# EAGLE board FLYTE_3.02 (EAGLE 9.6.2)
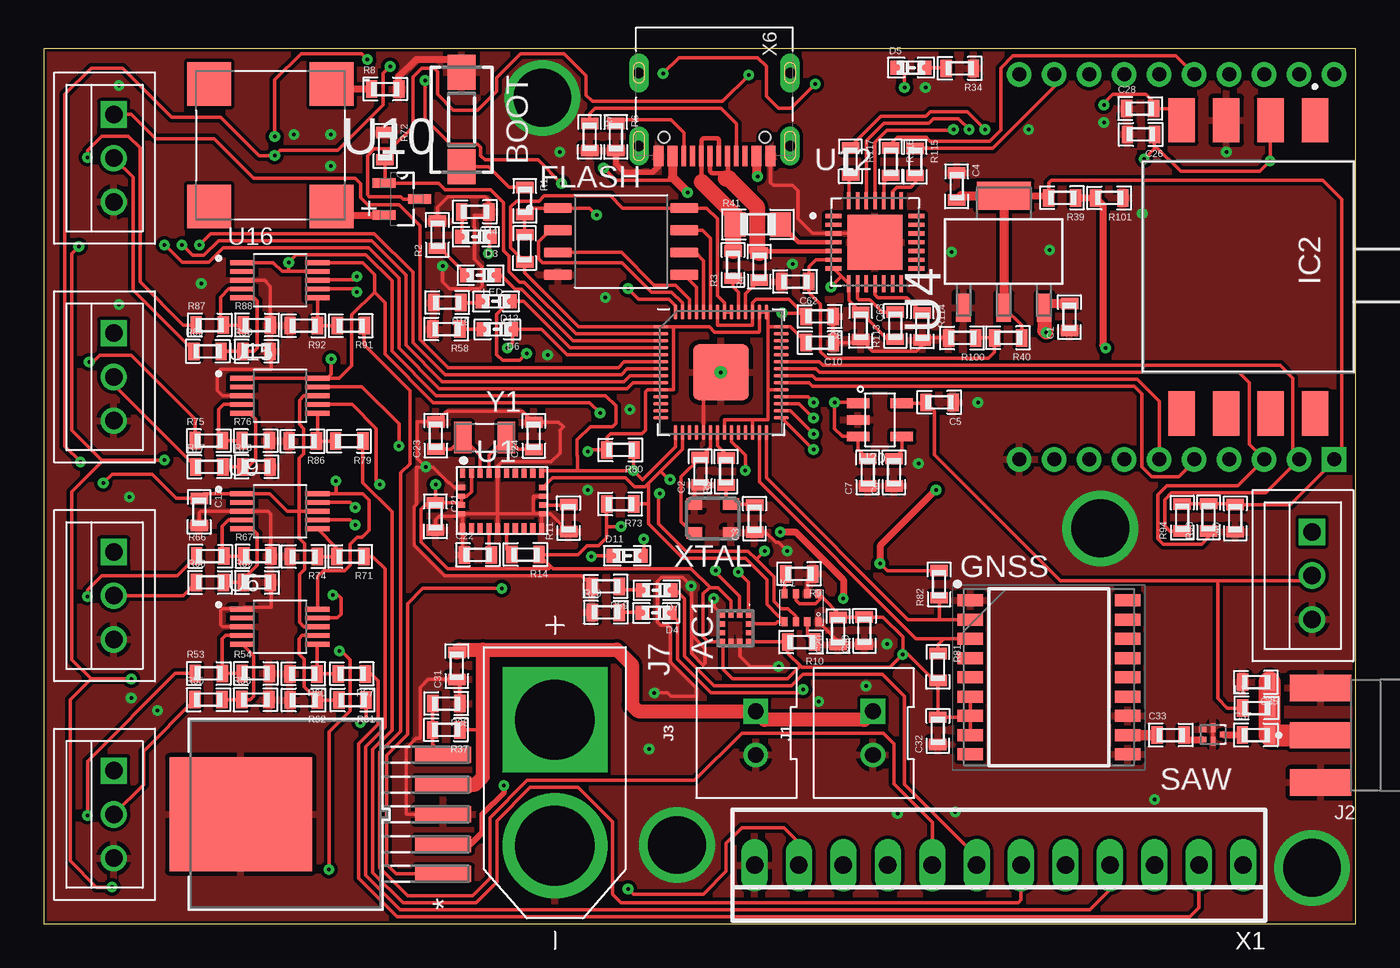
[diagram p8: board, top side]
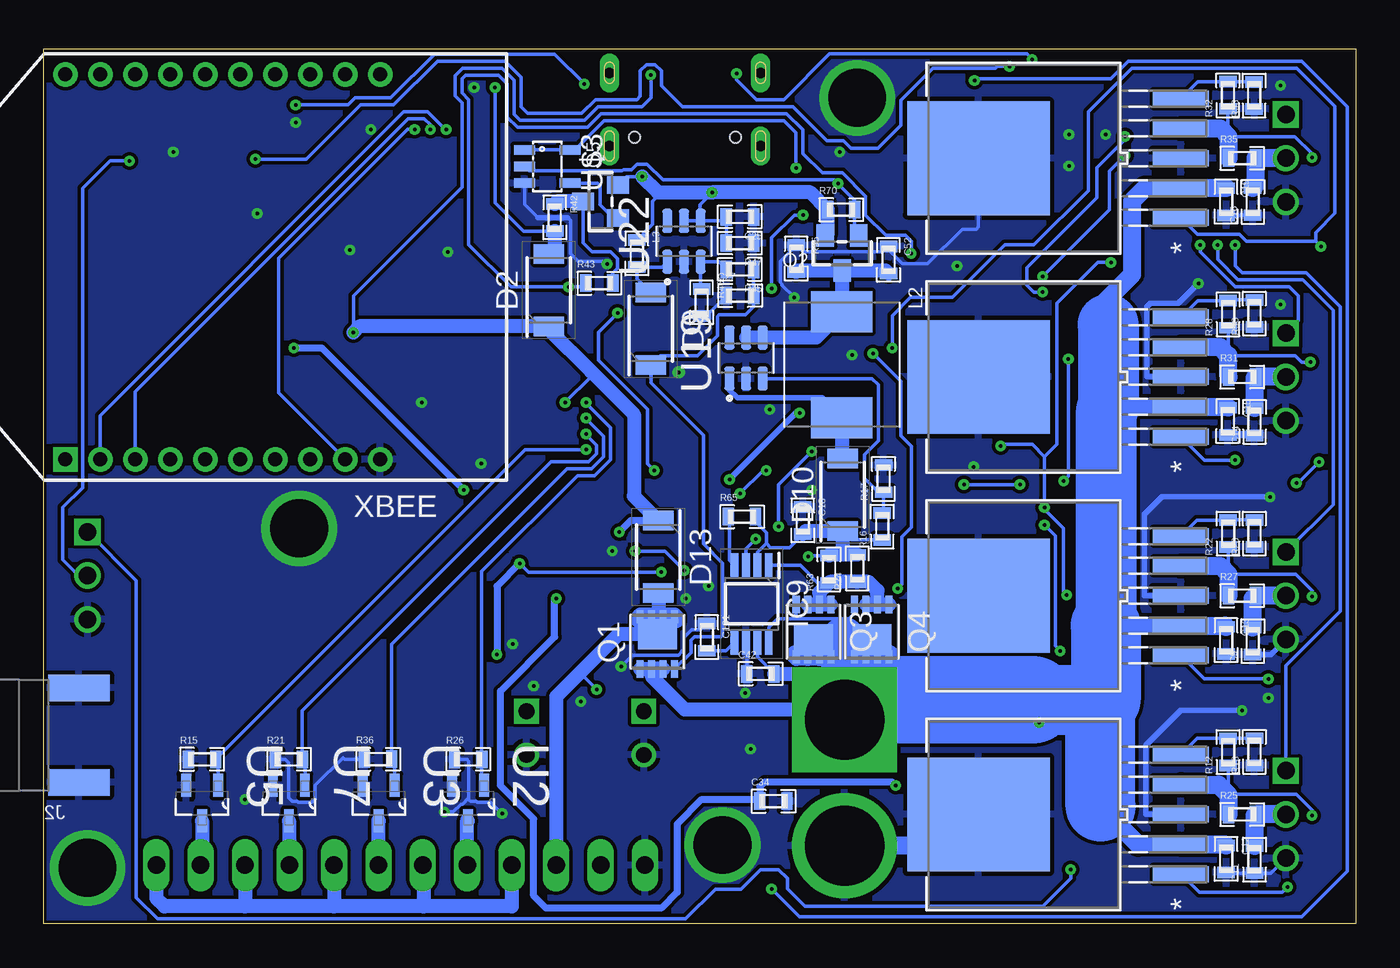
[diagram p9: board, bottom side, seen from below]

Size 75 x 50 mm. Coordinates in mm from the lower left corner, seen from the top.
Outline: 0,0 75,0 75,50 0,50 0,0
Copper layers (1*16): Top 0.07mm / dielectric 1.5mm / Bottom 0.07mm
Design rules "default *": minimum track width 0.2mm, minimum drill 0.2mm, track to track 0.2mm, track to pad 0.2mm, pad to pad 0.2mm, via to via 0.2mm, smd to smd 0.2mm, copper to edge 0.175mm, drill to drill 6mil, minimum pad ring 10mil, minimum via ring 8mil, stop-mask expansion 4mil, vias tented up to drill 0mil, thermal gap 10mil

## Footprints (pad centres in the part's own frame; a part is rotated, then mirrored left to right if it is on the bottom)
KX1341211 = smd 0.3 x 0.3: 1 -0.762,0.75; 2 -0.762,0.25; 3 -0.762,-0.25; 4 -0.762,-0.75; 5 -0.25,-0.75; 6 0.25,-0.75; 7 0.762,-0.75; 8 0.762,-0.25; 9 0.762,0.25; 10 0.762,0.75; 11 0.25,0.75; 12 -0.25,0.75
DTSM-3 = smd 2 x 1.6: 1 -2.7,0; 2 2.7,0
CUI_CMT-8530S-SMT = smd 2.5 x 2.5: 1 -3.5,3.5; 2 -3.5,-3.5; N 3.5,3.5; P 3.5,-3.5
0603 = smd 0.65 x 1: 1 -0.775,0; 2 0.775,0
SODFL4725X105N = smd 1.12 x 1.72: 1 -2.075,0; 2 2.075,0
0603.LED = smd 0.8 x 0.8: P$1 -0.775,0; P$2 0.775,0
B3B-XH = drill 1 square: P$1 2.5,0 | drill 1: P$2 0,0; P$3 -2.5,0
SOIC127P790X216-8N = smd 1.61 x 0.58: 1 -3.605,1.905; 2 -3.605,0.635; 3 -3.605,-0.635; 4 -3.605,-1.905; 5 3.605,-1.905; 6 3.605,-0.635; 7 3.605,0.635; 8 3.605,1.905
SON110P970X1010X230-18N = smd 1.45 x 0.686: 1 -4.5,4.4; 2 -4.5,3.3; 3 -4.5,2.2; 4 -4.5,1.1; 5 -4.5,0; 6 -4.5,-1.1; 7 -4.5,-2.2; 8 -4.5,-3.3; 9 -4.5,-4.4; 10 4.5,-4.4; 11 4.5,-3.3; 12 4.5,-2.2; 13 4.5,-1.1; 14 4.5,0; 15 4.5,1.1; 16 4.5,2.2; 17 4.5,3.3; 18 4.5,4.4
BMP280 = smd 0.35 x 0.5: 1 0.975,-0.8; 2 0.325,-0.8; 3 -0.325,-0.8; 4 -0.975,-0.8; 5 -0.975,0.8; 6 -0.325,0.8; 7 0.325,0.8; 8 0.975,0.8
MPXV5100DP = smd 2.54 x 1.52: 1 8.38,-3.81; 2 8.38,-1.27; 3 8.38,1.27; 4 8.38,3.81; 5 -8.38,3.81; 6 -8.38,1.27; 7 -8.38,-1.27; 8 -8.38,-3.81
SOP65P490X110-8N = smd 1.4 x 0.45: 1 -2.2,0.975; 2 -2.2,0.325; 3 -2.2,-0.325; 4 -2.2,-0.975; 5 2.2,-0.975; 6 2.2,-0.325; 7 2.2,0.325; 8 2.2,0.975
B2B-XH-A = drill 0.9 square: 1 1.25,0 | drill 0.9: 2 -1.25,0
RFSOLUTIONS_CON-SMA-EDGE-S = smd 3.5 x 1.5: 1 0,0; G1 0,2.7; G2 0,-2.7 | smd 3.5 x 1.5 bottom: G3 0,2.7; G4 0,-2.7
AMASS_XT60-M = drill 4.55 pad 6: N 3.6,0 | drill 4.55 pad 6 square: P -3.6,0
IND_ASPI-0630LR-220M-T15 = smd 2.35 x 3.5: 1 -3.025,0; 2 3.025,0
SIS862DNT1GE3 = smd 0.99 x 0.405: 1 -1.555,0.992; 2 -1.555,0.332; 3 -1.555,-0.328; 4 -1.555,-0.988 | smd 0.51 x 0.405: 5 1.555,-0.988; 6 1.555,-0.328; 7 1.555,0.332; 8 1.555,0.992 | smd 1.725 x 2.235: 9 0.438,0.002 | smd 0.25 x 0.2: 10 1.175,-1.096; 11 1.175,1.096
SOT23-WIDE = smd 1 x 1.27: 1 -0.95,-1; 2 0.95,-1; 3 0,1
0805 = smd 1.2 x 1.4: 1 -1.3,0; 2 1.3,0
RP2040-QFN-56 = smd 0.875 x 0.2: 1 -3.438,2.6; 2 -3.438,2.2; 3 -3.438,1.8; 4 -3.438,1.4; 5 -3.438,1; 6 -3.438,0.6; 7 -3.438,0.2; 8 -3.438,-0.2; 9 -3.438,-0.6; 10 -3.438,-1; 11 -3.438,-1.4; 12 -3.438,-1.8; 13 -3.438,-2.2; 14 -3.438,-2.6; 29 3.438,-2.6; 30 3.438,-2.2; 31 3.438,-1.8; 32 3.438,-1.4; 33 3.438,-1; 34 3.438,-0.6; 35 3.438,-0.2; 36 3.438,0.2; 37 3.438,0.6; 38 3.438,1; 39 3.438,1.4; 40 3.438,1.8; 41 3.438,2.2; 42 3.438,2.6 | smd 0.2 x 0.875: 15 -2.6,-3.438; 16 -2.2,-3.438; 17 -1.8,-3.438; 18 -1.4,-3.438; 19 -1,-3.438; 20 -0.6,-3.438; 21 -0.2,-3.438; 22 0.2,-3.438; 23 0.6,-3.438; 24 1,-3.438; 25 1.4,-3.438; 26 1.8,-3.438; 27 2.2,-3.438; 28 2.6,-3.438; 43 2.6,3.438; 44 2.2,3.438; 45 1.8,3.438; 46 1.4,3.438; 47 1,3.438; 48 0.6,3.438; 49 0.2,3.438; 50 -0.2,3.438; 51 -0.6,3.438; 52 -1,3.438; 53 -1.4,3.438; 54 -1.8,3.438; 55 -2.2,3.438; 56 -2.6,3.438 | smd 3.2 x 3.2: 57 0,0 | drill 0.2 pad 0.6: 62 0,0
FIL_AFS14A04-1575.42-T3 = smd 0.425 x 0.325: A 0.588,0.287; C -0.588,0; E 0.588,-0.287 | smd 0.25 x 0.525: B 0,0.388; D 0,-0.388
LGA28R50P4X10_380X520X100 = smd 0.3 x 0.525: 1 -2.25,1.562; 6 -2.25,-1.562; 7 -1.75,-1.562; 8 -1.25,-1.562; 9 -0.75,-1.562; 10 -0.25,-1.562; 11 0.25,-1.562; 12 0.75,-1.562; 13 1.25,-1.562; 14 1.75,-1.562; 15 2.25,-1.562; 20 2.25,1.562; 21 1.75,1.562; 22 1.25,1.562; 23 0.75,1.562; 24 0.25,1.562; 25 -0.25,1.562; 26 -0.75,1.562; 27 -1.25,1.562; 28 -1.75,1.562 | smd 0.425 x 0.3: 2 -2.312,0.75; 3 -2.312,0.25; 4 -2.312,-0.25; 5 -2.312,-0.75; 16 2.312,-0.75; 17 2.312,-0.25; 18 2.312,0.25; 19 2.312,0.75
SOT91P240X120-3N = smd 1.321 x 0.559: 1 -1.016,0.914; 2 -1.016,-0.914; 3 1.016,0
SOT230 = smd 1.6 x 0.838: 1 -3.2,2.311; 2 -3.2,0; 3 -3.2,-2.311 | smd 1.6 x 3.099: 4 3.2,0
SOP50P490X110-10N = smd 1.47 x 0.28: 1 -2.15,1; 2 -2.15,0.5; 3 -2.15,0; 4 -2.15,-0.5; 5 -2.15,-1; 6 2.15,-1; 7 2.15,-0.5; 8 2.15,0; 9 2.15,0.5; 10 2.15,1
TO-263-5_MCH-L = smd 0.914 x 3.2: 1 -3.404,-9.004; 2 -1.702,-9.004; 3 0,-9.004; 4 1.702,-9.004; 5 3.404,-9.004 | smd 6.502 x 8.153: 6 0,2.565
QFN50P500X500X100-29N = smd 0.97 x 0.26: 1 -2.37,1.5; 2 -2.37,1; 3 -2.37,0.5; 4 -2.37,0; 5 -2.37,-0.5; 6 -2.37,-1; 7 -2.37,-1.5; 15 2.37,-1.5; 16 2.37,-1; 17 2.37,-0.5; 18 2.37,0; 19 2.37,0.5; 20 2.37,1; 21 2.37,1.5 | smd 0.26 x 0.97: 8 -1.5,-2.37; 9 -1,-2.37; 10 -0.5,-2.37; 11 0,-2.37; 12 0.5,-2.37; 13 1,-2.37; 14 1.5,-2.37; 22 1.5,2.37; 23 1,2.37; 24 0.5,2.37; 25 0,2.37; 26 -0.5,2.37; 27 -1,2.37; 28 -1.5,2.37 | smd 3.15 x 3.15: 29 0,0
SOT95P280X145-6N = smd 1.37 x 0.59: 1 -1.17,0.95; 2 -1.17,0; 3 -1.17,-0.95; 4 1.17,-0.95; 5 1.17,0; 6 1.17,0.95
SOT-23-5_RAW = smd 0.55 x 1.3: 1 -0.95,-1.25; 2 0,-1.25; 3 0.95,-1.25; 4 0.95,1.25; 5 -0.95,1.25
SOT23-5 = smd 0.55 x 1.2: 1 -0.95,-1.3; 2 0,-1.3; 3 0.95,-1.3; 4 0.95,1.3; 5 -0.95,1.3
22-23-2121 = drill 1 long: 1 -13.97,0; 2 -11.43,0; 3 -8.89,0; 4 -6.35,0; 5 -3.81,0; 6 -1.27,0; 7 1.27,0; 8 3.81,0; 9 6.35,0; 10 8.89,0; 11 11.43,0; 12 13.97,0
USB_C_CUSB31-CFM2AX-01-X = smd 0.575 x 1.15: A1B12 -3.2,3.545; A4B9 -2.4,3.545; B1A12 3.2,3.545; B4A9 2.4,3.545 | smd 0.275 x 1.15: A5 -1.25,3.545; A6 -0.25,3.545; A7 0.25,3.545; A8 1.25,3.545; B5 1.75,3.545; B6 0.75,3.545; B7 -0.75,3.545; B8 -1.75,3.545 | drill 0.6 pad 1 long: M1 -4.32,2.97; M2 4.32,2.97; M3 -4.32,-1.21; M4 4.32,-1.21 | hole 0.65: 2.89,2.47; -2.89,2.47
DIP2200W51P200L3294H279Q20P = drill 0.8 pad 1.4 square: 1 -11,8.75 | drill 0.8 pad 1.4: 2 -11,6.75; 3 -11,4.75; 4 -11,2.75; 5 -11,0.75; 6 -11,-1.25; 7 -11,-3.25; 8 -11,-5.25; 9 -11,-7.25; 10 -11,-9.25; 11 11,-9.25; 12 11,-7.25; 13 11,-5.25; 14 11,-3.25; 15 11,-1.25; 16 11,0.75; 17 11,2.75; 18 11,4.75; 19 11,6.75; 20 11,8.75
ASE = smd 0.9 x 0.65: 1 -1.05,-0.825; 2 1.05,-0.825; 3 1.05,0.825; 4 -1.05,0.825
XTAL_FC-135_32.7680KA-A0 = smd 1 x 1.8: 1 -1.25,0; 2 1.25,0

## Placement (x,y rotation side)
AC1  KX134-1211  [KX1341211]  39.53,16.89 270 top
BOOT  DTSM-3  [DTSM-3]  23.88,45.95 270 top
BUZZER  BUZZER  [CUI_CMT-8530S-SMT]  12.96,44.49 0 top
C1  10 uF  [0603]  58.63,34.68 90 top
C2  18 pF  [0603]  37.53,25.87 90 top
C3  18 pF  [0603]  40.63,23.16 90 top
C4  10 uF  [0603]  52.19,42.14 270 top
C5  10 uF  [0603]  51.2,29.8 180 top
C6  100 pF  [0603]  48.6,25.8 90 top
C7  10 uF  [0603]  47.1,25.8 90 top
C8  10 uF  [0603]  44.35,34.71 180 top
C9  10 uF  [0603]  5.89,16.16 90 bottom
C10  10 uF  [0603]  44.37,33.21 180 top
C11  10 uF  [0603]  5.79,3.68 90 bottom
C12  10 uF  [0603]  7.41,3.71 270 bottom
C13  10 uF  [0603]  7.41,16.2 270 bottom
C14  10 uF  [0603]  5.79,28.69 90 bottom
C15  10 uF  [0603]  7.31,28.72 270 bottom
C16  10 uF  [0603]  5.89,41.27 90 bottom
C17  10 uF  [0603]  8.89,23.54 270 top
C18  10\ uF  [0603]  31.61,23.05 270 bottom
C19  10 uF  [0603]  7.41,41.26 270 bottom
C20  10 uF  [0603]  45.41,16.73 90 top
C21  10 uF  [0603]  22.39,23.28 270 top
C22  100 nF  [0603]  24.81,21.09 0 top
C23  27 pF  [0603]  22.41,27.9 90 top
C24  27 pF  [0603]  28.01,27.89 90 top
C25  10 uF  [0603]  35.2,40.4 180 bottom
C26  10 uF  [0603]  62.72,45.11 180 top
C27  10\ uF  [0603]  35.2,35.9 0 bottom
C28  470 pF  [0603]  62.67,46.59 0 top
C30  10 uF  [0603]  46.91,16.75 90 top
C31  10 uF  [0603]  23.61,14.74 90 top
C32  10 uF  [0603]  51.11,11.03 90 top
C33  120 pF  [0603]  64.42,10.79 0 top
C34  10 uF  [0603]  33.29,7.01 0 bottom
C35  120 pF  [0603]  69.3,13.81 180 top
C37  120 pF  [0603]  69.29,10.79 0 top
C40  10 uF  [0603]  68.11,23.18 90 top
C42  10 uF  [0603]  34.03,14.29 0 bottom
C52  10 uF  [0603]  26.71,37.94 270 bottom
C62  10 uF  [0603]  42.96,36.7 180 top
C63  10 uF  [0603]  46.7,34.17 270 top
C101  100 nF  [0603]  37.1,16.38 270 bottom
D2  RSX501LAM20TR  [SODFL4725X105N]  46.13,36.21 90 bottom
D3  [0603.LED]  24.7,39.27 180 top
D4  [0603.LED]  35.01,17.77 180 top
D5  [0603.LED]  49.58,48.93 0 top
D6  [0603.LED]  25.93,33.97 180 top
D7  [0603.LED]  35.04,19.07 180 top
D9  RSX501LAM20TR  [SODFL4725X105N]  40.3,34 90 bottom
D10  RSX501LAM20TR  [SODFL4725X105N]  29.33,24.52 90 bottom
D11  [0603.LED]  33.35,21.03 0 top
D12  [0603.LED]  25.86,35.57 180 top
D13  RSX501LAM20TR  [SODFL4725X105N]  39.87,20.97 270 bottom
FIN_1  03-JST-B3B-XH-A  [B3B-XH]  4,6.25 90 top
FIN_2  03-JST-B3B-XH-A  [B3B-XH]  4,18.75 90 top
FIN_3  03-JST-B3B-XH-A  [B3B-XH]  4,31.25 90 top
FIN_4  03-JST-B3B-XH-A  [B3B-XH]  4,43.75 90 top
FLASH  W25Q128JVSIQ  [SOIC127P790X216-8N]  33,39 0 top
GNSS  TESEO-LIV3F  [SON110P970X1010X230-18N]  57.46,14.09 0 top
IC1  BMP280  [BMP280]  43.32,18.07 0 top
IC2  MPXV5100DP  [MPXV5100DP]  68.86,37.54 90 top
IC9  MCP73844-840I_MS  [SOP65P490X110-8N]  34.53,18.29 270 bottom
J1  JST-XH-2B  [B2B-XH-A]  47.4,10.9 90 top
J2  CON-SMA-EDGE-S  [RFSOLUTIONS_CON-SMA-EDGE-S]  72.99,10.78 180 top
J3  JST-XH-2B  [B2B-XH-A]  40.7,10.9 90 top
J7  XT60-M  [AMASS_XT60-M]  29.22,8.06 270 top
L1  [0603]  69.31,12.33 0 top
L2  ASPI-0630LR-220M-T15  [IND_ASPI-0630LR-220M-T15]  29.38,31.95 270 bottom
L3  22 uH  [0603]  41.1,38.3 270 bottom
LED  [0603.LED]  24.97,37.07 180 top
MOTOR  03-JST-B3B-XH-A  [B3B-XH]  72.5,19.9 90 top
Q1  SI7625DN-T1-GE3  [SIS862DNT1GE3]  39.92,16.12 90 bottom
Q2  [SOT23-WIDE]  29.37,38.33 180 bottom
Q3  SI7625DN-T1-GE3  [SIS862DNT1GE3]  31,16.69 270 bottom
Q4  SI7625DN-T1-GE3  [SIS862DNT1GE3]  27.67,16.69 270 bottom
Q5  [SOT23-WIDE]  43.17,41.28 90 bottom
R0  10k ohm  [0603]  27.49,38.6 270 top
R1  1k ohm  [0603]  27.5,41.31 270 top
R2  100 ohm  [0603]  22.5,39.38 90 top
R3  27.4 ohm  [0603]  39.4,37.67 90 top
R4  27.4 ohm  [0603]  40.9,37.56 90 top
R5  1k ohm  [0603]  39,25.85 90 top
R6  5.1k ohm  [0603]  32.7,44.96 270 top
R7  5.1k ohm  [0603]  31.2,44.97 270 top
R8  100 ohm  [0603]  19.52,47.7 0 top
R9  10k ohm  [0603]  43.19,20 180 top
R10  10k ohm  [0603]  43.3,16.1 180 top
R11  10k ohm  [0603]  30,23.19 90 top
R12  45k ohm  [0603]  7.3,9.82 90 bottom
R13  10k ohm  [0603]  5.8,9.83 90 bottom
R14  10k ohm  [0603]  27.54,21.1 180 top
R15  10k ohm  [0603]  65.95,9.4 0 bottom
R16  145k ohm  [0603]  27.07,22.71 90 bottom
R17  10k ohm  [0603]  27,25.44 90 bottom
R19  100 ohm  [0603]  23.07,35.5 180 top
R21  10k ohm  [0603]  60.99,9.4 0 bottom
R22  45k ohm  [0603]  7.3,22.3 90 bottom
R23  10k ohm  [0603]  5.8,22.31 90 bottom
R24  0.13 ohm  [0603]  28.5,20.32 90 bottom
R25  0.13 ohm  [0603]  6.5,6.25 0 bottom
R26  10k ohm  [0603]  50.74,9.4 0 bottom
R27  0.13 ohm  [0603]  6.5,18.75 0 bottom
R28  45k ohm  [0603]  7.3,34.84 90 bottom
R29  100 ohm  [0603]  32.13,17.8 0 top
R30  10k ohm  [0603]  5.8,34.88 90 bottom
R31  0.13 ohm  [0603]  6.5,31.25 0 bottom
R32  45k ohm  [0603]  7.31,47.35 90 bottom
R33  10k ohm  [0603]  5.81,47.34 90 bottom
R34  100 ohm  [0603]  52.37,48.89 180 top
R35  0.13 ohm  [0603]  6.5,43.75 0 bottom
R36  10k ohm  [0603]  55.89,9.41 0 bottom
R37  30k ohm  [0603]  23,11.09 180 top
R38  10k ohm  [0603]  23.01,12.59 180 top
R39  0 ohm  [0603]  58.22,41.49 180 top
R40  0 ohm  [0603]  55.13,33.49 180 top
R41  0 ohm  [0805]  40.82,39.97 0 top
R42  0 ohm  [0603]  45.79,40.36 270 bottom
R43  0 ohm  [0603]  43.25,36.61 0 bottom
R44  100 ohm  [0603]  24.66,40.69 180 top
R45  190k ohm  [0603]  35.2,37.4 180 bottom
R46  10k ohm  [0603]  37.4,35.5 270 bottom
R47  10k ohm  [0603]  35.2,38.9 180 bottom
R53  10k ohm  [0603]  9.43,14.31 0 top
R54  10k ohm  [0603]  12.12,14.31 0 top
R55  10k ohm  [0603]  9.41,12.81 0 top
R56  10k ohm  [0603]  12.1,12.81 0 top
R57  10k ohm  [0603]  17.61,14.29 180 top
R58  100 ohm  [0603]  23.02,33.99 180 top
R59  315 ohm  [0603]  32.13,19.29 180 top
R60  10k ohm  [0603]  14.84,14.29 180 top
R61  10k ohm  [0603]  17.65,12.79 180 top
R62  10k ohm  [0603]  14.86,12.79 180 top
R63  0.13 ohm  [0603]  30.11,20.27 90 bottom
R65  100k ohm  [0603]  35.09,23.27 0 bottom
R66  10k ohm  [0603]  9.52,21.01 0 top
R67  10k ohm  [0603]  12.21,21.01 0 top
R68  10k ohm  [0603]  9.5,19.51 0 top
R69  10k ohm  [0603]  12.19,19.51 0 top
R70  10k ohm  [0603]  29.42,40.81 0 bottom
R71  10k ohm  [0603]  17.53,20.99 180 top
R72  10k ohm  [0603]  19.51,44.44 270 top
R73  10k ohm  [0603]  32.95,23.99 180 top
R74  10k ohm  [0603]  14.86,20.99 180 top
R75  10k ohm  [0603]  9.43,27.61 0 top
R76  10k ohm  [0603]  12.12,27.61 0 top
R77  10k ohm  [0603]  9.46,26.12 0 top
R78  10k ohm  [0603]  12.15,26.12 0 top
R79  10k ohm  [0603]  17.46,27.58 180 top
R80  10k ohm  [0603]  32.97,27.08 180 top
R81  10k ohm  [0603]  51.12,14.68 270 top
R82  10k ohm  [0603]  51.18,19.41 90 top
R86  10k ohm  [0603]  14.8,27.58 180 top
R87  10k ohm  [0603]  9.49,34.22 0 top
R88  10k ohm  [0603]  12.18,34.22 0 top
R89  10k ohm  [0603]  9.37,32.72 0 top
R90  10k ohm  [0603]  12.16,32.72 0 top
R91  10k ohm  [0603]  17.55,34.18 180 top
R92  10k ohm  [0603]  14.86,34.18 180 top
R93  10k ohm  [0603]  66.58,23.23 90 top
R94  10k ohm  [0603]  65.08,23.22 90 top
R95  10k ohm  [0603]  31.98,38.01 270 bottom
R100  10k ohm  [0603]  52.5,33.48 180 top
R101  10k ohm  [0603]  60.91,41.48 180 top
R113  10k ohm  [0603]  48.68,34.18 90 top
R114  10k ohm  [0603]  50.22,34.13 270 top
R115  0 ohm  [0603]  49.82,43.54 270 top
R116  0 ohm  [0603]  48.42,43.55 270 top
R117  0 ohm  [0603]  46.12,43.56 270 top
RP2040  RP2040-QFN56  [RP2040-QFN-56]  38.71,31.52 0 top
SAW  SAW_FILTER  [FIL_AFS14A04-1575.42-T3]  66.84,10.82 180 top
U1  BNO055  [LGA28R50P4X10_380X520X100]  26.2,24.18 0 top
U2  CJ3400  [SOT91P240X120-3N]  50.75,6.9 270 bottom
U3  CJ3400  [SOT91P240X120-3N]  55.85,6.9 270 bottom
U4  LM1117-3.3  [SOT230]  54.88,38.42 90 top
U5  CJ3400  [SOT91P240X120-3N]  65.95,6.9 270 bottom
U6  ADS1115IDGSR  [SOP50P490X110-10N]  13.5,16.98 0 top
U7  CJ3400  [SOT91P240X120-3N]  60.98,6.9 270 bottom
U8  MIC29302WU-TRTO-263-5_MCH-L  [TO-263-5_MCH-L]  13.83,6.26 90 top
U9  ADS1115IDGSR  [SOP50P490X110-10N]  13.5,23.58 0 top
U10  CJ3400  [SOT91P240X120-3N]  20.48,41.42 0 top
U11  MIC29302WU-TRTO-263-5_MCH-L  [TO-263-5_MCH-L]  19,6.25 90 bottom
U12  CP2102  [QFN50P500X500X100-29N]  47.52,38.95 0 top
U13  MIC29302WU-TRTO-263-5_MCH-L  [TO-263-5_MCH-L]  19,18.75 90 bottom
U14  MIC29302WU-TRTO-263-5_MCH-L  [TO-263-5_MCH-L]  19,31.25 90 bottom
U15  ADS1115IDGSR  [SOP50P490X110-10N]  13.5,30.18 0 top
U16  ADS1115IDGSR  [SOP50P490X110-10N]  13.5,36.78 0 top
U17  MIC29302WU-TRTO-263-5_MCH-L  [TO-263-5_MCH-L]  19,43.75 90 bottom
U19  MT3608  [SOT95P280X145-6N]  34.85,32.33 90 bottom
U20  AP2210K-3.3TRG1  [SOT-23-5_RAW]  47.8,28.8 270 top
U22  MT3608  [SOT95P280X145-6N]  38.4,39 90 bottom
U$3  SN74LVC1G04DBVR  [SOT23-5]  46.22,43.28 270 bottom
X1  22-23-2121  [22-23-2121]  54.6,3.35 180 top
X6  USB Type C  [USB_C_CUSB31-CFM2AX-01-X]  38.34,47.42 180 top
XBEE  XBP9B-XCST-021  [DIP2200W51P200L3294H279Q20P]  65.02,37.54 90 bottom
XTAL  ASE  [ASE]  38.24,23.16 180 top
Y1  FC-135_32.7680KA-A0  [XTAL_FC-135_32.7680KA-A0]  25.2,27.78 0 top

## Tracks (layer width: path | path; a pad name or v marks a point on that pad's centre or on a via)
1V1  (via drill 0.2)
  Top 0.2: RP2040.50 38.51,34.22 40.51,34.22 RP2040.45 40.51,35.49 40.72,35.7 42.59,35.7 C8.2 43.38,34.9 v42.2,34.9 | RP2040.23 39.31,27.55 39.61,27.25 39.62,27.25 40.1,26.77 v40.1,25.9
  Bottom 0.2: v40.1,25.9 40.5,26.3 40.5,29.4 43.3,32.2 43.3,33.8 v42.2,34.9
3V3
  Top 0.2: U4.2 55.91,34.2 R40.1 | R94.2 65.09,24 R93.2 68.06,24 C40.2 71.25,23.95 73.77,26.47 73.77,26.5 | 73.77,26.5 XBEE.1 | R39.2 57.45,42.34 57.6,42.5 73.1,42.5 74.2,41.4 74.2,26.93 73.77,26.5
  Top 0.406: U4.4 57.31,41.62 R39.2
  Top 0.508: C4.2 52.45,41.62 U4.4 U4.2
3V3_OP  (via drill 0.2)
  Top 0.2: RP2040.48 RP2040.49 38.91,35.49 38.51,35.89 38.51,40.29 37.9,40.91 FLASH.8 33.09,40.91 32.4,41.6 28.61,41.6 28.32,41.3 27.02,41.3 26.69,40.97 26.69,38.62 R0.2 27.49,37.21 30.58,34.12 RP2040.1 36.01,34.12 | C10.2 42.69,34.12 RP2040.42 41.41,34.12 | RP2040.26 40.51,28.82 40.52,28.82 | 40.52,28.82 41.41,28.82 41.41,30.5 | 36.01,34.12 36.01,30.52 RP2040.10 34.52,30.52 34.4,30.4 34.4,28.2 34.2,28 32.4,28 32.2,27.8 R80.2 31.18,27.08 v31.1,27 | 41.41,34.12 41.41,34.96 RP2040.43 RP2040.44 40.91,33.85 40.88,33.82 38.34,33.82 38.04,34.12 36.01,34.12 | RP2040.22 38.91,28.82 40.52,28.82 | GNSS.6 GNSS.7 | GNSS.7 GNSS.8 | C21.1 23.76,24.05 U1.4 U1.3 24.17,24.43 24.45,24.71 U1.28 | 44.36,18.8 45.66,17.5 C20.2 45.43,17.52 C30.2 47.98,17.52 49.1,16.4 v49.1,15.4 | 44.36,18.8 IC1.8 | IC1.6 42.99,18.5 43.2,18.3 44.1,18.3 44.36,18.56 44.36,18.8 | GNSS.7 52.87,11.8 C32.2 51.12,11.81 R81.2 | R81.2 | U15.7 17.62,29.68 19,28.3 19,25.3 v19.2,25.1 | AC1.3 39.28,18.47 38.55,19.2 38.1,19.2 | 38.1,19.2 38.05,19.2 37.7,18.85 37.7,16.4 37.97,16.13 AC1.7 38.83,16.08 38.83,14.55 39.38,14 42.5,14 43.2,14.7 43.3,14.7 | R81.2 50.9,13.9 49.4,15.4 v49.1,15.4 | AC1.1 40.28,19.52 v39.7,20.1 | 29.01,20.41 R14.1 30.55,21.1 31.05,21.6 31.7,21.6 32.17,22.07 32.17,22.7 | 29.01,20.41 29.11,20.3 37,20.3 38.1,19.2 | C21.1 22.4,24.07 v22.4,25.1 | v47.8,20.6 48.22,20.18 R82.2 | 43.3,14.7 43.34,14.66 48.36,14.66 v49.1,15.4 | 32.17,22.7 R73.2 | 41.41,30.5 41.41,34.12 | 41.41,30.5 41.43,30.52 RP2040.33 | v33,22.7 32.17,22.7 | 29.01,20.41 28.89,20.29 23.09,20.29 21.58,21.8 21.58,23.68 21.95,24.05 C21.1 | 43.3,14.7 42.52,15.47 R10.2 42.5,16.13 AC1.10
  Top 0.406: R39.1 R101.2 60.53,41.08 60.53,33.06 v60.7,32.9 | v51,24.8 47.8,21.6 v47.8,20.6
  Bottom 0.2: v39.7,20.1 47.3,20.1 v47.8,20.6 | v19.2,25.1 v22.4,25.1 | v33,22.7 33,25.1 v31.1,27
  Bottom 0.406: v51,24.8 59.1,32.9 v60.7,32.9 | v47.8,20.6 49.1,19.3 v49.1,15.4
3V3_SET
  Top 0.2: U12.6 44.15,37.95 43.73,37.53 C62.1 43.73,36.06 44.4,35.4 44.4,32.71 44.79,32.32 54,32.32 54.35,32.67 54.35,33.4 | R40.2 54.35,33.4 | R100.1 54.27,33.48 54.35,33.4
5V  (via drill 0.2)
  Top 0.2: IC2.2 70.1,45.89 v70.1,43.6 69.5,43 65,43 63.49,44.51 C26.1 63.49,44.3 v62.9,43.7 | U20.5 50.38,29.75 C5.2 50.92,29.3 50.92,26.8 58.12,19.6 67.1,19.6 | MOTOR.P$2 72.2,19.6 67.1,19.6 | 14.6,23.58 13.92,23.58 12.92,24.58 U9.1 9.15,24.58 C17.1 7.58,24.32 6.2,25.7 3.9,25.7 v3.4,25.2 | 14.6,23.58 U9.8 | L1.1 67.67,12.33 67.1,12.9 67.1,19.6 | 14.6,23.58 14.6,22.02 14.91,21.71 14.91,20.27 14.62,19.97 14.62,17.24 14.87,16.98 U6.8 | U15.8 14.87,30.18 14.62,29.92 14.62,28.54 14.85,28.3 14.85,26.86 14.6,26.61 14.6,23.58 | U16.8 15.67,36.8 17.7,36.8 v17.9,37 | v19.8,49 19.4,48.6 19.4,46.8 16.8,44.2 13.5,44.2 v13.2,43.9 12.3,43.9 10.1,46.1 7.3,46.1 4.5,48.9 2.7,48.9 1.2,47.4 1.2,27.3 v2.1,26.4
  Bottom 0.2: MOTOR.P$2 73,19.9 73.9,20.8 73.9,23.8 72.77,24.93 72.77,42.03 71.2,43.6 v70.1,43.6 | v17.9,37 14.1,40.8 14.1,43 v13.2,43.9 | v19.8,49 20.5,49 20.6,48.9 24.17,48.9 25.99,47.08 25.99,45.64 27.32,44.31 28.85,44.31 29.28,44.74 30.22,44.74 32.18,46.7 38.5,46.7 39.7,47.9 39.7,48.75 40.05,49.1 40.55,49.1 40.9,48.75 40.9,47.3 41.1,47.1 43.47,47.1 44.25,46.32 47.33,46.32 47.71,46.7 47.71,48.37 48.63,49.3 52.5,49.3 55,46.8 56.9,46.8 60,43.7 v62.9,43.7 | v2.1,26.4 3.3,25.2 v3.4,25.2
BC  (via drill 0.2)
  Top 0.2: X1.11 43.17,4.63 42.3,5.5 39.9,5.5 39,4.6 39,3 37.7,1.7 33.7,1.7 v33.4,2 | v21.8,48.2 21.8,46 23.25,44.55 24.8,44.55 24.98,44.37 24.98,43.9 25.23,43.65 28.25,43.65 v29.6,42.3
  Bottom 0.2: Q2.1 28.64,39.55 R70.2 28.64,41.34 v29.6,42.3 29.81,42.51 39.61,42.51 40.51,43.41 41.09,43.41 41.4,43.1 41.87,43.1 41.94,43.03 47.27,43.03 U$3.2 | v33.4,2 31.8,0.4 3.1,0.4 0.5,3 0.5,46.7 3.1,49.3 13,49.3 14,48.3 21.7,48.3 v21.8,48.2
BUZZER
  Top 0.2: R72.2 19.51,42.38 U10.1 22.57,42.33 22.96,41.95 25.55,41.95 26.29,41.21 26.29,38.46 26.6,38.15 26.6,37.28 27.21,36.67 27.47,36.67 30.42,33.72 RP2040.2
CAM  (via drill 0.2)
  Top 0.2: RP2040.4 30.09,32.92 27.43,35.57 D12.P$1 25.89,34.83 25.89,32.53 26.22,32.2 27.2,32.2 v27.6,32.6 | v26.19,19.17 21.67,19.17 20.8,18.3 20.8,10.84 19.6,9.64 19.6,3.4 20.14,2.86 U8.1
  Bottom 0.2: v27.6,32.6 26,31 26,27.9 25.4,27.3 25.4,22.67 25.94,22.12 25.94,19.42 v26.19,19.17
CC1
  Top 0.2: R7.1 31.2,46.3 31.5,46.6 38.7,46.6 39.59,45.71 X6.A5
CC2
  Top 0.2: R6.1 32.9,45.94 35.87,45.94 36.59,45.21 X6.B5
CSB
  Top 0.2: IC1.2 43.65,16.53 R10.1
CTRL  (via drill 0.2)
  Top 0.2: v26.5,32.9 26.8,33.2 26.8,33.88 D6.P$1 28.47,33.97 29.92,32.52 RP2040.5 | v2,38.7 1.6,38.3 1.6,28.2 3.3,26.5 3.4,26.5 | 3.4,26.5 v6.9,26.5 | v5,14 2.7,14 | 2.7,14 1.6,15.1 1.6,24.7 3.4,26.5 | v3.9,2.1 3,2.1 1.5,3.6 1.5,12.8 2.7,14
  Bottom 0.2: v26.5,32.9 26.5,34.76 25.46,35.8 23.05,35.8 20.05,38.8 18.4,38.8 15.3,41.9 15.3,46.4 12.8,48.9 3.37,48.9 1.2,46.73 1.2,40.6 2.3,39.5 2.3,39 | v6.9,26.5 8.65,26.5 U14.1 | v2,38.7 2.3,39 | v5,14 8.65,14 U13.1 | v3.9,2.1 4.2,1.8 8.95,1.8 U11.1 | 2.3,39 6.25,39 6.65,39.4 9.05,39.4 U17.1
CTS
  Top 0.2: R115.1 54.24,44.31 57.77,47.84 XBEE.12
D1
  Top 0.2: FIN_1.P$2 5.7,7.95 5.7,9.88 R55.1
  Bottom 1.016: FIN_1.P$2 R25.2 5.79,6.18 C11.2
D2
  Top 0.2: FIN_2.P$2 7.96,18.75 R68.1
  Bottom 1.016: FIN_2.P$2 R27.2 5.89,18.59 C9.2
D3
  Top 0.2: R77.1 4,30.8 FIN_3.P$2
  Bottom 1.016: FIN_3.P$2 R31.2 5.79,31.18 C14.2
D4
  Top 0.2: FIN_4.P$2 5.1,42.65 5.1,36.22 R89.1
  Bottom 1.016: FIN_4.P$2 R35.2 5.72,42.21 C16.2
D+
  Top 0.254: X6.A6 38.6,44.8 38.5,44.9 37.7,44.9 37.59,44.79 X6.B6 37.59,42.41 37.6,42.4
  Top 0.9: R3.2 39.4,39.85 R41.1 39.52,40.48 37.6,42.4
D+1
  Top 0.254: U12.4 43.14,38.95 R41.2
D-
  Top 0.254: X6.A7 38.09,43.01 38.2,42.9 39,42.9 39.1,43 | 39.1,43 39.1,43.87 X6.B7 | 39.1,43 39.1,42.46 38.98,42.58 | 40.77,38.6 40.93,38.44 U12.5
  Top 0.9: R4.2 40.77,38.47 40.77,38.6 40.77,40.99 39.18,42.58 38.98,42.58
DROGUE  (via drill 0.2)
  Top 0.2: RP2040.29 42.18,28.92 v44,27.1
  Bottom 0.2: v44,27.1 47.48,27.1 R15.2 65.04,9.26 U5.1
DTR  (via drill 0.2)
  Top 0.2: R117.1 46.12,44.41 47.85,46.14 50.42,46.14 50.68,46.4 52.8,46.4 v53.8,45.4
  Bottom 0.2: v53.8,45.4 54.2,45.4 61.57,38.03 61.57,30.34 XBEE.9
FIN_1  (via drill 0.2)
  Top 0.2: RP2040.9 33.68,30.92 33.35,30.59 22.6,30.59 20.3,32.89 20.3,36.9 18.57,38.64 10.26,38.64 9.42,37.8 7.9,37.8 v6.9,38.8
  Bottom 0.2: FIN_1.P$1 4,14.76 0.9,17.86 0.9,35.27 2.83,37.2 6.5,37.2 6.9,37.6 v6.9,38.8
FIN_2  (via drill 0.2)
  Top 0.2: RP2040.8 33.51,31.32 33.18,30.99 22.76,30.99 20.7,33.05 20.7,37.07 18.73,39.04 9.99,39.04 9.15,38.2 8.5,38.2 v7.9,38.8
  Bottom 0.2: FIN_2.P$1 1.3,23.95 1.3,35.07 3.03,36.8 6.73,36.8 7.9,37.97 v7.9,38.8
FIN_3  (via drill 0.2)
  Top 0.2: RP2040.7 33.34,31.72 33.02,31.39 22.93,31.39 21.1,33.22 21.1,37.23 18.89,39.44 9.54,39.44 v8.9,38.8
  Bottom 0.2: v8.9,38.8 8.9,38.4 6.9,36.4 3.8,36.4 3.3,35.9 3.3,34.45 FIN_3.P$1
FIN_4
  Top 0.2: RP2040.6 33.18,32.12 32.85,31.79 23.1,31.79 21.5,33.39 21.5,39.9 20.32,41.09 18.68,41.09 18.65,41.05 18.55,41.05 18.1,41.5 18.1,42.3 17.8,42.6 12,42.6 9.75,44.85 6.4,44.85 5,46.25 FIN_4.P$1
GND  (via drill 0.2, 3.3, 3.3 pad 3.2)
  Top 0.2: R100.2 50.34,33.48 R114.2 50.22,33.05 49.88,32.72 47.38,32.72 C63.2 46.52,33.21 C10.1 45.12,33.23 C8.1 | R38.1 23.79,13.79 C31.1 21.96,13.96 21.5,13.5 21.5,10.6 21.29,10.6 20.7,10.01 20.7,6.3 20.74,6.26 U8.3 | U16.3 12.62,36.78 12.96,36.45 R88.2 | U15.3 10.22,30.18 9.9,30.5 9.9,31.5 10.1,31.7 13,31.7 13,32.66 R90.2 | C17.2 8.89,23.49 8.98,23.58 U9.3 12.82,23.58 12.98,23.41 R67.2 | U6.3 10.22,16.98 10.1,17.1 10.1,17.9 10.2,18 11.33,18 U6.1 11.47,18.1 13,18.1 13,19.48 R69.2 | X6.A1B12 41.54,42.36 41.7,42.2 42.8,42.2 43.1,41.9 43.1,40.3 43.95,39.45 U12.3 47.02,39.45 U12.29 | AC1.9 39.8,16.11 39.8,15.3 40.4,14.7 v42,14.7 | AC1.4 38.3,18.13 v38.3,18.6 | RP2040.19 37.71,30.52 RP2040.62 | IC1.7 43.65,19.68 R9.1 | IC1.1 45.41,16.16 C20.1 | v42.5,21.3 42,21.8 41.85,21.8 41.26,22.39 C3.1 | v37,19.3 36.5,19.8 35.32,19.8 35.09,19.56 35.09,17.25 35.26,17.07 35.65,17.07 35.81,16.9 35.81,14.95 37.3,13.47 37.3,13 36.35,13 35.85,13 35.65,13.2 v34.9,13.2 35.09,13.38 | U1.16 28.98,23.43 R11.1 | U1.5 23.95,23.43 U1.6 23.95,21.18 C22.1 | U1.5 25.95,23.43 | 25.95,23.43 28,23.43 | U1.18 28,24.43 28,23.43 | U1.16 28,23.43 | 23.2,25.2 | 23.2,25.2 23.15,25.2 22.25,26.1 21.84,26.1 | 21.84,26.1 21.3,26.1 21.3,23.97 21.18,23.85 21.18,21.63 22.92,19.89 30.75,19.89 R59.2 | 21.84,26.1 v21.84,26.12 21.34,26.62 21.34,28.7 22.39,28.7 C23.2 23.02,29.29 27.39,29.29 C24.2 29.43,28.66 29.7,28.4 29.5,28.2 29.5,26.9 29,26.4 26.2,26.4 25.95,26.15 U1.25 25.95,23.43 | U1.10 25.95,23.43 | SAW.D SAW.B | XTAL.2 37.19,24.75 C2.1 | U1.16 28.45,23.37 U1.15 | 37.02,16.52 37.02,15.45 37.68,14.78 37.8,14.9 37.8,15.73 37.02,16.52
  Top 0.2: 37.02,16.52 37.02,19.09 | v22.8,37.6 22.8,36.7 23.2,36.3 24.9,36.3 25.05,36.45 25.05,37.55 24.62,37.98 24.62,39.79 24.6,39.82 24.6,40.5 25.25,40.5 R44.1 25.43,41.37 25.25,41.55 23.1,41.55 22.5,40.95 R2.2 | U1.5 23.76,23.3 22.6,23.3 22.39,23.09 C21.2 | U1.2 23.47,24.93 23.2,25.2
  Top 0.305: X6.B1A12 35.14,43.29 34.8,42.95 33.17,42.95 32.7,43.43 R6.2
  Top 0.406: R8.2 20.3,48.4 21.3,49.4 23.13,49.4 BOOT.1
  Bottom 0.2: R36.1 57.81,9.41 57.9,9.5 59.49,7.91 59.49,7.13 59.66,6.96 60.47,6.96 60.51,7 60.8,7 61,7.2 61,9.2 61.2,9.4 R21.1 | v48.8,6.3 49.46,6.96 50.24,6.96 50.28,7 50.6,7 50.7,7.1 50.7,7.2 | R26.1 50.8,9.4 50.7,9.3 50.7,7.2 | C16.1 7.4,40.49 C19.2 | 34.85,14.34 C42.1 34.8,16.04 IC9.6 | v42,14.7 41.34,15.36 38.72,15.36 38.51,15.57 38.51,15.6 38.4,15.7 38.4,16.37 37.97,16.8 37.45,16.8 C101.1 | 50.7,7.2 51.06,6.84 51.15,6.84 51.6,6.4 v52.1,6.4 | FIN_1.P$3 4.84,2.9 C11.1 7.38,2.9 C12.2 | U17.6 21.57,39.84 21.7,39.7 22.5,39.7 24.49,37.71 25.91,37.71 26.71,38.51 C52.1 27.03,38.4 31.59,38.4 R95.1 32.9,37.87 32.9,36.65 32.8,36.55 32.8,36.5 v32.1,35.8 | C27.1 37.15,34.73 R46.2 | U$3.3 47.52,41.12 46.75,40.35 | 45.05,40.35 44.9,40.2 44.9,38.3 44.45,37.85 42.95,37.85 v42.8,37.7
  Bottom 0.305: v9,36.6 10.14,35.46 11.74,35.46 11.95,35.26 11.95,31.25 U14.3 | v4.9,24.4 11.1,24.4 12.1,23.4 12.1,18.75 U13.3 | FIN_2.P$3 4.87,15.38 C9.1 | v6.5,12.2 10.01,12.2 12,10.21 12,6.25 U11.3 | 46.75,40.35 45.05,40.35
  Bottom 0.406: C14.1 5.82,27.95 C15.2
  Bottom 1.016: U11.6 23.36,4.46 J7.N
  other vias: 67.6,44.1 60.6,45.8 51.9,38.4 53.4,29.8 62.8,40.6 57.5,38.5 14.3,45.1 4.3,47.9 16.4,45.1 4.3,35.4 5,12.9 56.3,45.4 60.4,22.6 36.2,4.5 28.5,47.2 31.1,24.8 28.8,32.5 48.2,16 34.6,10 44.3,12.7 47,13.6 33.5,29.4 63.5,7.1 29.5,44.1 50,26.3 50.4,47.8 16.4,43.3 72.5,3.2
  pour Bottom: -9.6,51.3 -9.6,-1 -4.6,-6 -4,-6.6 86.6,-6.6 87.2,-6 87.2,51 85.4,52.8 -8.4,52.8 -9.6,51.6
  pour Top: -10.8,51.7 -10.8,-2.8 -7.1,-6.5 88.9,-6.5 88.9,51.5 86.1,54.3 -8.2,54.3
GPS_RX
  Top 0.2: RP2040.27 40.91,25.25 49.87,16.29 51.47,16.29 | GNSS.3 51.47,16.29 | R81.1 51.12,15.94 51.47,16.29
GPS_TX
  Top 0.2: GNSS.2 51.2,17.39 | 51.2,17.39 49.4,17.39 41.31,25.48 RP2040.28 | R82.1 51.2,18.61 51.2,17.39
IGN1  (via drill 0.2)
  Top 0.2: RP2040.31 43.18,29.72 v44,28.9
  Bottom 0.2: v44,28.9 44,28.85 43,27.85 43,26.68 43.68,26 45.1,26 55.12,15.98 R36.2 54.94,9.23 U3.1
IGN2  (via drill 0.2)
  Top 0.2: RP2040.32 43.68,30.12 v44,29.8
  Bottom 0.2: v44,29.8 44,29.75 42.6,28.35 42.6,26.52 43.52,25.6 44.5,25.6 49.97,20.14 R26.2 49.97,8.04 U2.1
LED
  Top 0.2: LED.P$1 26.14,37.07 26.95,36.27 27.3,36.27 30.25,33.32 RP2040.3
MAIN  (via drill 0.2)
  Top 0.2: RP2040.30 42.68,29.32 v44,28
  Bottom 0.2: v44,28 44,27.95 43.4,27.35 43.4,26.85 43.85,26.4 45.99,26.4 60.22,12.17 R21.2 60.07,9.25 U7.1
MOS  (via drill 0.2)
  Top 0.2: D4.P$1 36.22,17.34 36.22,15.12 38.13,13.2 43.2,13.2 v43.4,13.4
  Bottom 0.2: v43.4,13.4 44.3,14.3 44.4,14.3
  Bottom 0.813: Q1.10 38.82,17.57 Q1.5 Q1.6 | Q1.6 Q1.7 Q1.8 41.02,17.57 Q1.11 | 39.87,17.4 Q1.6 | D13.2 39.87,17.4 | 39.87,17.4 39.92,17.34 Q1.9 42.14,16.56 44.4,14.3 45.71,12.99 X1.10
N$2
  Top 0.2: R2.1 22.66,38.6 LED.P$2
N$3
  Top 0.2: C3.2 40.58,23.98 XTAL.1 39,24.27 R5.1
N$4
  Top 0.61: GNSS.11 C33.1
N$5
  Bottom 0.2: R13.2 R12.2 9.05,10.6 U11.5
N$6
  Top 0.406: R8.1 16.75,47.7 BUZZER.N
N$7
  Top 0.2: D12.P$2 25.02,35.5 R19.1
N$8
  Bottom 0.2: IC9.1 31.75,20.49 30.76,19.5 R63.1
  Bottom 0.813: Q4.1 arc1 Q4.2 | Q4.3 arc1 Q4.2 | Q3.1 arc1 Q3.2 | Q3.3 arc1 Q3.2 | Q4.2 27.34,19.04 27.84,19.55 R24.1 30.06,19.55 R63.1 30.67,18.94 Q3.2
N$9
  Top 0.406: BUZZER.P 16.94,40.51 U10.2
N$10
  Top 0.2: C22.2 25.45,21.23 U1.9
N$11
  Top 0.2: U1.17 29.96,23.93 R11.2
N$12
  Bottom 0.2: R23.2 7.29,23.09 R22.2 9.07,23.07 U13.5
N$13
  Bottom 0.2: R30.2 7.26,35.66 R28.2 9.03,35.62 U14.5
N$14
  Bottom 0.2: R33.2 R32.2 9.02,48.12 U17.5
N$15
  Top 0.2: U1.11 26.45,21.41 R14.2
N$16  (via drill 0.2)
  Top 0.2: v34.3,22 34.3,21.2 D11.P$2
  Bottom 0.2: v34.3,22 34.85,21.45 IC9.3
N$17
  Top 1.27: C35.1 L1.2 70.06,12.33 C37.2 J2.1
N$18
  Bottom 0.305: U19.1 35.8,30.5 35.36,30.06 30.51,30.06 L2.2
  Bottom 0.813: L2.2 29.38,26.64 D10.2
N$19
  Bottom 0.2: R16.2 27,23.55 R17.1 27.3,24.66 28.1,25.46 28.1,26.8 27.3,27.6 27.3,30.8 27.66,31.16 U19.3
N$20
  Top 0.2: R55.2 R56.1 11.81,12.81 12,13 12,15.33 U6.5
N$21
  Top 0.2: R54.1 R53.2 10.21,16.3 10.4,16.5 11.33,16.5 U6.4
N$22
  Top 0.406: SAW.C 68.48,10.82 C37.1
N$23
  Top 0.2: R44.2 23.93,40.65 D3.P$2
N$24
  Top 0.406: C33.2 65.45,10.53 SAW.A
N$26
  Top 0.2: U12.9 46.52,35.75 46.6,35.67 47.22,35.67 47.94,34.95 R113.2
N$27
  Top 0.2: R38.2 R37.2 22.23,10.27 U8.5
N$29
  Top 0.2: R57.2 R60.1 15.62,15.95 U6.6
N$30
  Top 0.2: R61.2 R62.1 14.89,13.54 14.89,15.11 14.6,15.4 14.6,16.3 14.78,16.48 U6.7
N$31
  Top 0.2: R67.1 R66.2 10.2,21.11 10.2,22.71 10.57,23.08 U9.4
N$32
  Top 0.2: R68.2 R69.1 11.41,19.71 12.2,20.5 12.2,22.3 11.92,22.58 U9.5
N$33
  Top 0.2: R74.1 R71.2 16.75,21.48 U9.6
N$34
  Top 0.2: R76.1 R75.2 10,27.82 10,29.4 10.28,29.68 U15.4
N$35
  Top 0.2: R77.2 R78.1 11.68,26.12 12.1,26.55 12.1,28.83 11.75,29.18 U15.5
N$36
  Top 0.2: R79.2 R86.1 15.65,27.66 U15.6
N$37
  Top 0.2: R88.1 R87.2 10.1,34.38 10.1,35.81 10.57,36.28 U16.4
N$38
  Top 0.2: R89.2 R90.1 12.02,32.72 12.2,32.9 12.2,35.6 12.02,35.78 U16.5
N$39
  Top 0.2: R92.1 15.9,34.18 | 15.9,34.18 R91.2 | U16.6 15.65,34.43 15.9,34.18
N$41
  Top 0.2: U12.11 47.52,35.94 47.68,35.78 49.34,35.78 R114.1
N$42
  Top 0.2: U12.23 48.52,41.84 48.78,42.1 49.56,42.1 49.82,42.37 R115.2
N$43
  Top 0.2: U12.24 48.02,42.38 R116.2
N$45
  Top 0.2: U12.28 46.02,42.69 R117.2
N$46
  Top 0.2: C6.2 49.05,27.02 U20.4
N$49
  Bottom 0.2: U22.1 39.66,37.52 L3.2 41.1,36.88 D9.2
N$50
  Bottom 0.2: R45.2 36.41,37.83 U22.3 37.45,36.33 R46.1
N$53
  Bottom 0.2: Q1.4 38,15.5 38,16.2 37.8,16.4 36.3,16.4 36.2,16.5 36.2,20.62 37.29,21.71 37.29,27.91 40.3,30.93 D9.1 39.75,32.47 37.63,32.47 36.5,33.6 36.5,34.7 36.4,34.8 34.9,34.8 34.42,35.27 C27.2 R45.1
N$54
  Top 0.2: R29.2 34.2,17.8 D4.P$2
N$55
  Top 0.2: D5.P$2 51.55,48.93 R34.2
N$97
  Top 0.2: D6.P$2 25.14,33.99 R58.1
N$98
  Top 0.2: D7.P$2 34.24,19.09 33.1,19.09 R59.1
N$108
  Bottom 0.2: IC9.4 35.8,20.79 35.8,23.21 R65.1
N$109
  Bottom 0.2: IC9.8 33.55,16.95 33.07,17.43 32.02,17.43 | 32.02,17.43 28.97,17.43 28.66,17.75 Q4.4 | Q3.4 31.99,17.47 32.02,17.43
N$110
  Bottom 0.2: C101.2 35.99,15.61 IC9.5
N$121
  Bottom 0.2: Q5.1 42.43,40.33 43.2,41.1 43.2,42.2 43.33,42.33 U$3.4
PYRO_DROGUE
  Top 0.2: X1.2 66.03,0.93 65.5,0.4 20.2,0.4 18,2.6 18,10.3 19.1,11.4 19.1,13.9 18.71,14.29 R57.1
  Bottom 0.813: U5.3 65.95,3.43 X1.2
PYRO_IGN1
  Top 0.2: R79.1 18.23,25.21 19.9,23.54 19.9,11.07 18.8,9.97 18.8,2.93 20.53,1.2 24.7,1.2 25.9,2.4 25.9,5.9 27.8,7.8 30.55,7.8 32.52,5.83 32.52,1.68 33,1.2 55.7,1.2 55.87,1.37 X1.6
  Bottom 0.813: U3.3 55.87,5.9 X1.6
PYRO_IGN2
  Top 0.2: R91.1 18.32,33.08 20.94,30.46 20.94,26.31 20.4,25.77 20.4,11 19.2,9.8 19.2,3.2 20.8,1.6 24.5,1.6 25.5,2.6 25.5,6.07 27.63,8.2 37.2,8.2 39.9,10.9 48,10.9 48.6,10.3 48.6,8 50.79,5.81 X1.8
  Bottom 0.813: X1.8 50.79,5.92 U2.3
PYRO_MAIN
  Top 0.2: R71.1 18.8,20.99 19.5,20.3 19.5,11.23 18.4,10.13 18.4,2.77 20.37,0.8 59.8,0.8 60.95,1.95 X1.4
  Bottom 0.813: U7.3 60.98,3.38 X1.4
QSPI_SCLK
  Top 0.2: FLASH.6 37.24,38.37 37.71,37.9 RP2040.52
QSPI_SD0
  Top 0.2: RP2040.53 37.31,36.39 FLASH.5
QSPI_SD1
  Top 0.2: FLASH.2 28.93,39.63 28.29,38.99 28.29,37.99 28.51,37.77 33.06,37.77 34.73,36.1 35.9,36.1 36.51,35.49 RP2040.55
QSPI_SD2
  Top 0.2: FLASH.3 33.03,38.37 34.9,36.51 36.1,36.51 36.91,35.7 RP2040.54
QSPI_SD3
  Top 0.2: FLASH.7 37.66,39.63 38.11,39.19 RP2040.51
QSPI_SS  (via drill 0.2)
  Top 0.2: R0.1 27.49,40.52 R1.2 27.87,40.91 FLASH.1 31.2,40.91 v31.6,40.5 | v33.4,36.3 33.99,35.7 35.73,35.7 36.11,35.32 RP2040.56
  Bottom 0.2: v31.6,40.5 32.1,40.5 33.4,39.2 v33.4,36.3
RSSI
  Top 0.2: RP2040.35 43.95,31.32 44.15,31.12 62.5,31.12 63.77,29.85 XBEE.6
RTS
  Top 0.2: XBEE.16 64.71,49.6 55.4,49.6 54.7,48.9 54.7,45.34 54.08,44.72 50.67,44.72 50.44,44.94 48.8,44.94 48.42,44.56 R116.1
SCL  (via drill 0.2)
  Top 0.2: U15.1 U15.10 16.2,31.18 | 16.7,24.58 18.22,24.58 18.6,24.2 18.6,22.5 18.2,22.1 17.9,22.1 17.5,21.7 17.5,20.49 17.2,20.19 15.99,20.19 15.65,19.85 U6.10 | 16.7,24.58 U9.10 | 16.2,31.18 16.88,31.18 17.6,31.9 17.6,34.8 18.9,36.1 | U16.10 18.22,37.78 18.9,37.1 18.9,36.1 | RP2040.16 36.51,27.11 35.25,25.85 | 34.58,25.18 35.25,25.85 | 34.58,24 34.58,22.85 36.53,20.9 40.1,20.9 41.33,19.67 41.33,18.27 41.98,17.62 41.99,17.62 IC1.4 41.95,17.27 41.81,17.14 AC1.12 | 34.58,24 34.58,25.18 | R73.1 34.58,24 | U1.19 29.08,25.5 33.25,25.5 33.76,24.98 34.38,24.98 34.58,25.18 | v16.7,25.3 16.7,24.58 | v16.43,32.28 16.43,31.41 16.2,31.18 | 18.9,36.1 18.9,36.08 19.5,35.48 19.5,32.56 22.27,29.79 31.21,29.79 v31.8,29.2 | v35.8,25.4 35.7,25.4 35.25,25.85
  Bottom 0.2: v16.43,32.28 16.43,25.57 v16.7,25.3
  Bottom 0.305: v35.8,25.4 32,29.2 v31.8,29.2
SDA  (via drill 0.2)
  Top 0.2: U16.1 13.12,37.78 13.62,37.28 14,37.28 | 14,37.28 U16.9 | U9.9 17.52,24.08 v17.8,23.8 | v20.3,27.3 20.3,28.57 18.19,30.68 U15.9 | v33.7,25.9 34.22,25.38 36.11,27.28 RP2040.15 | v35.2,24.6 35.14,24.54 35.14,22.86 36.7,21.3 40.27,21.3 40.73,20.83 | IC1.3 42.99,17.57 42.55,18.02 42.15,18.02 41.73,18.43 41.73,19.83 40.73,20.83 | U1.20 28.61,25.9 30.5,25.9 | 30.5,25.9 v33.7,25.9 | v38.4,20.2 38.4,20.1 39.78,18.72 AC1.2 | v41.2,21.3 40.73,20.83 | v33.7,25.9 33.7,27.04 R80.1 | 14,37.28 v14,37.8 14.44,38.24 18.4,38.24 19.9,36.74 19.9,32.72 22.43,30.19 32.11,30.19 32.7,29.6 32.7,28.6 32.5,28.4 31.25,28.4 30.5,27.65 30.5,26.75 30.5,25.9 | v16.52,18.8 16.8,18.8 17,18.6 17,17.7 16.78,17.48 U6.9
  Bottom 0.2: v33.7,25.9 33.9,25.9 v35.2,24.6 | v41.2,21.3 39.5,21.3 v38.4,20.2 | 17.8,26.7 v17.8,23.8 17.8,23.7 16.72,22.62 16.72,19 v16.52,18.8 | 17.8,26.7 18.5,27.4 20.2,27.4 v20.3,27.3 | v14,37.8 14.75,37.8 17.1,35.45 17.1,27.4 17.8,26.7
SDO
  Top 0.2: R9.2 42.34,19.93 IC1.5
TEL_RST
  Top 0.2: RP2040.34 43.75,30.92 43.95,30.72 62.33,30.72 62.77,30.28 62.77,26.13 63.36,25.54 64.88,25.54 65.77,26.43 XBEE.5
TEL_RX  (via drill 0.2)
  Top 0.2: U12.26 47.02,44.74 48.02,45.74 50.59,45.74 50.85,46 52.3,46 v52.9,45.4 | RP2040.36 44.15,31.72 44.35,31.52 68.3,31.52 68.9,30.92 68.9,27.41 XBEE.3 68.26,25.03 64.2,25.03 63.68,24.51 63.68,22.02 64,21.7 66.2,21.7 66.58,22.08 R93.1
  Bottom 0.2: v52.9,45.4 52.9,45.65 53.25,46 54.16,46 69.77,30.4 XBEE.3
TEL_TX  (via drill 0.2)
  Top 0.2: U12.25 47.52,44.67 48.19,45.34 51.94,45.34 v52,45.4 | RP2040.37 44.35,32.12 44.55,31.92 70.68,31.92 71.41,31.19 71.41,26.87 71.74,26.54 XBEE.2 69.86,24.63 64.47,24.63 64.08,24.24 64.08,22.75 64.38,22.45 R94.1
  Bottom 0.2: v52,45.4 52.05,45.4 53.05,46.4 54.42,46.4 71.77,29.05 XBEE.2
USB+  (via drill 0.2)
  Top 0.2: v32,43.2 32.7,42.5 36.1,42.5
  Top 0.508: X6.B4A9 35.94,42.66 36.1,42.5 v36.8,41.8 | X6.A4B9 40.74,42.76 v40.8,42.7
  Bottom 0.2: C25.2 35.98,40.2 | 35.98,40.2 R47.2 | 35.98,40.2 36.01,40.17 U22.4 37.5,40.17 | 37.5,40.17 U22.5 | v36.8,41.8 37.5,41.1 37.5,40.17 | L3.1 40.2,39.98 40.2,41.3 39.7,41.8 | U$3.1 U$3.5 44.64,44.23 42.97,45.9 32.7,45.9 32,45.2 v32,43.2 | v40.8,42.7 41.7,42.7 Q5.2
  Bottom 0.813: v40.8,42.7 39.9,41.8 39.7,41.8 v36.8,41.8 31.18,41.8 R70.1 30.2,39.45 Q2.2
USB_BOOT
  Top 0.2: R1.1 26.6,42.09 25.43,43.25 BOOT.2
USB_BST  (via drill 0.2)
  Top 0.2: v31.3,21 31.33,21.03 D11.P$1
  Bottom 0.2: R16.1 28.82,21.93 D10.1 | R63.2 31.25,21.05 v31.3,21 | IC9.2 34.2,21.24 33.7,21.75 | 33.7,21.75 33.7,22.35 34.31,22.97 R65.2 | C18.2 32.38,21.5 33.45,21.5 33.7,21.75
  Bottom 0.813: C18.2 31.44,22.45 D10.1 29.33,21.12 29.3,21.09 | R24.2 29.3,21.09 | 29.3,21.09 30.06,21.09 R63.2
USB_CHG
  Bottom 0.813: U19.5 arc-1 U19.4 30.86,33.5 29.68,34.68 L2.1 Q2.3 | C52.2 26.88,37.33 Q2.3 | Q2.3 31.89,37.33 R95.2
USB_DM
  Top 0.2: RP2040.46 40.11,35.99 R4.1
USB_DP
  Top 0.2: R3.1 39.4,36.4 39.71,36.09 RP2040.47
V_CAM
  Top 0.2: R37.1 23.79,11.1 25.11,11.1
  Top 0.813: U8.4 24.66,7.96 25.11,8.41 25.11,11.1 25.11,15.67 | 25.11,15.67 32.77,15.67 33.63,14.81 33.63,12.5 33.98,12.15 J3.1 41.2,11.65 46.9,11.65 J1.1 | C31.2 23.76,15.67 25.11,15.67
V_FIN_1  (via drill 0.2)
  Top 0.2: v2.5,6.2 2.5,9.3 7.51,14.31 R53.1
  Bottom 0.2: R12.1 7.3,7.4 7.28,7.38 7.25,7.4 3.4,7.4 2.5,6.5 v2.5,6.2
  Bottom 1.016: U11.4 7.85,7.95 7.28,7.38 R25.1
V_FIN_2  (via drill 0.2)
  Top 0.2: v2.5,18.7 2.5,19.1 3.3,19.9 7.63,19.9 R66.1
  Bottom 0.2: R22.1 7.28,21.5 7.28,19.98 3.43,19.98 2.5,19.04 v2.5,18.7
  Bottom 1.016: U13.4 7.75,20.45 7.28,19.98 R27.1
V_FIN_3  (via drill 0.2)
  Top 0.2: v2.6,32.1 2.8,32.1 3.2,32.5 5,32.5 8.65,28.84 R75.1
  Bottom 0.2: v2.6,32.1 3.1,32.1 3.45,32.45 7.25,32.45 7.3,32.4 | R28.1 7.3,32.4 | 7.3,32.4 7.3,31.27 R31.1
  Bottom 1.016: R31.1 7.28,32.48 7.75,32.95 U14.4
V_FIN_4  (via drill 0.2)
  Top 0.2: v2.5,43.8 2.5,44.2 3.3,45 4.84,45 5.5,44.34 5.5,36.68 7.96,34.22 R87.1
  Bottom 0.2: R32.1 7.31,45.01 7.28,44.98 3.48,44.98 2.5,44 v2.5,43.8
  Bottom 1.016: U17.4 7.75,45.45 7.28,44.98 R35.1
VBUS
  Bottom 0.2: R43.2 42.48,37.17 42.2,37.45 42.2,38 42.6,38.4 43.66,38.4 44.17,38.91 Q5.3
  Bottom 0.813: Q5.3 45.65,41.28 R42.1
VBUS_OP  (via drill 0.2)
  Top 0.2: D5.P$1 49.2,48.53 v49.2,47.8
  Bottom 0.2: R42.2 47.59,39.59 49.2,41.2 v49.2,47.8
  Bottom 0.813: R42.2 45.79,38.62 D2.2
VBUS_SET  (via drill 0.2)
  Top 0.2: U12.7 45.6,37 | 45.6,37 U12.8 46.02,35.62 C63.1 48.24,33.41 R113.1 | v45,36.4 45.6,37 | D3.P$1 25.48,38.38 v25.41,38.31
  Bottom 0.2: R43.1 44.23,36.4 v45,36.4 48.29,36.4 50.7,38.81 50.7,47.1 51.1,47.5 51.1,48.3 50.9,48.5 49,48.5 48.51,48.01 48.51,46.09 47.93,45.51 43.92,45.51 43.14,46.3 32.53,46.3 31.6,45.37 31.6,44.01 30.5,42.91 29.35,42.91 28.02,41.57 28.02,40.5 26.86,39.34 25.74,39.34 25.41,39.01 v25.41,38.31
VCC  (via drill 0.2)
  Top 0.2: U20.1 46.5,29.8 v45.2,29.8 45.2,28.3 45.65,27.85 U20.3 46.55,27.12 C7.2 | U10.3 20.55,41.42 20.41,41.55 18.61,41.55 18.5,41.67 18.5,43.9 18.89,44.29 19.83,44.29 21.1,45.56 21.1,48.4 21.6,48.9 22.3,48.9 22.5,48.7 22.5,47.4 23.4,46.5 24.8,46.5 25.89,47.59 25.89,48.36 27.24,49.71 29.76,49.71 31.01,48.46 31.01,47.36 31.36,47 38.8,47 v40.3,48.5
  Top 0.305: U8.2 24.41,4.56 25.05,5.2 25.05,6.25 26.3,7.5 v26.3,7.9
  Top 0.406: v45.7,18.6 45.7,19.66 42.96,22.4 v42.1,22.4
  Top 0.508: U4.3 57.43,35.45 C1.2
  Top 0.813: U4.3 57.19,33.91 v57.3,33.8
  Bottom 0.2: v45.2,29.8 43.73,31.27 43.73,31.57 | v57.3,33.8 57.3,35.9 51.1,42.1 51.1,46.93 51.5,47.33 51.5,48.47 51.07,48.9 48.8,48.9 48.11,48.21 48.11,46.26 47.77,45.92 44.08,45.92 43.3,46.7 40.8,46.7 40.3,47.2 v40.3,48.5
  Bottom 0.406: v45.7,18.6 45.8,18.5 45.8,16.4 48.9,13.3 48.9,7.9 47,6 47,1.6 46.3,0.9 39.7,0.9 38.8,1.8 38.8,5.7 37.39,7.11 34.16,7.11 C34.1 34.06,7.83 33.8,8.1 26.5,8.1 v26.3,7.9 | D13.1 41.45,23.05 v42.1,22.4
  Bottom 0.813: D13.1 41.27,24.45 41.27,29.12 43.73,31.57 46.13,33.98 D2.1 56.97,34.13 v57.3,33.8
VCC_PYRO
  Top 0.2: X1.7 53.33,3.84 49.2,7.97 49.2,13 47.95,14.25 43.4,14.25 42.75,13.6 38.3,13.6 36.62,15.29 36.62,18.59 36.13,19.07 D7.P$1
  Bottom 0.813: X1.9 48.25,1 53.3,1 | 53.3,1 58.41,1 | X1.1 68.57,1.47 68.1,1 63.5,1 | X1.7 53.3,3.32 53.3,1 | X1.5 58.41,1 | 58.41,1 63.5,1 | X1.3 63.49,1.01 63.5,1
VOLT_DP  (via drill 0.2)
  Top 0.2: IC2.4 64.38,46.59 C28.2 63.45,46.95 63,47.4 61.1,47.4 60.6,46.9 v60.6,46.8 | U16.7 17.72,36.28 v17.9,36.1 | v13.2,45 13.2,48.23 14.7,49.73 18.18,49.73 v18.5,49.4 | v35.4,48.6 36.3,49.5 40.8,49.5 41.3,49 41.3,47.3 42,46.6 42.7,46.6 v44.1,48
  Bottom 0.2: v17.9,36.1 18.4,36.1 18.8,36.5 18.8,37.5 14.8,41.5 14.8,43.2 13.2,44.8 v13.2,45 | v18.5,49.4 18.81,49.71 30.09,49.71 32.7,47.1 34.25,47.1 35.4,48.25 v35.4,48.6 | v44.1,48 45.8,49.7 52.67,49.7 55.17,47.2 57.2,47.2 57.6,46.8 v60.6,46.8
VOLT_MOTOR  (via drill 0.2)
  Top 0.2: U9.7 17.52,23.08 v17.8,22.8 | v16.3,3.1 16.3,10.97 17.5,12.17 17.5,15.1 17,15.6 v16.9,15.6
  Bottom 0.2: MOTOR.P$1 69.7,19.6 69.7,1.5 68.49,0.29 38.31,0.29 36.61,1.99 35.14,1.99 34.04,3.1 33,3.1 32.5,2.6 32.5,2 31.5,1 17.9,1 16.3,2.6 v16.3,3.1 | v16.9,15.6 17.18,15.88 17.18,22.18 v17.8,22.8
XIN
  Top 0.2: RP2040.20 38.11,27.23 C2.2 36.44,25.55 36.44,22.98 37.09,22.34 XTAL.3
XIN32
  Top 0.2: C23.1 23.3,27.12 Y1.1 24.95,26.78 U1.27
XOUT
  Top 0.2: RP2040.21 38.51,27.32 39,26.82 R5.2
XOUT32
  Top 0.2: U1.26 25.45,26.78 Y1.2 27.11,27.11 C24.1
XT60+  (via drill 0.2)
  Top 0.2: v18.1,11.5 18.43,11.82 R61.1
  Bottom 0.2: C42.2 34.2,15.26 IC9.7 | v18.1,11.5 18.5,11.9 18.5,12.8
  Bottom 0.813: Q4.11 26.57,15.24 Q4.8 Q4.7 Q4.6 | Q4.6 Q4.5 28.77,15.24 Q4.10 | Q4.6 28,15.92 Q4.9 29.3,16.25 Q3.9 31,15.51 Q3.7 | Q3.11 29.9,15.24 Q3.8 Q3.7 | Q3.7 Q3.6 Q3.5 32.1,15.24 Q3.10 | C42.2 30.35,14.29 29.3,13.24 | Q1.1 arc1 Q1.2 | Q1.3 arc1 Q1.2 | J7.P 29.82,12.26 38.36,12.26 40.25,14.15 Q1.2
  Bottom 1.016: U13.2 7.48,17.05 C13.1 | C12.1 7.47,4.55 U11.2 12.45,4.55 14.6,6.7 | C15.1 7.36,29.55 U14.2 14.05,29.55 14.2,29.4 | U13.2 14.3,17.05 | C19.1 9.98,42.03 U17.2 12.05,42.05 12.8,41.3 12.8,37.1 14.3,35.6 14.3,34.4 14.15,34.25 | U13.2 14.15,17.05 14.25,16.95
  Bottom 2.54: 29.3,16.25 arc1 29.3,13.24 arc1 29.3,11.74 J7.P
  Bottom 3.5: 14.25,16.95 14.25,29.35 14.2,29.4 14.15,29.45 14.15,34.25
  Bottom 4: 18.5,12.8 14.6,12.8 | 14.6,12.8 14.3,12.8 14.3,17.05 | 14.6,6.7 14.6,12.8
  Bottom 5: J7.P 28.08,12.8 18.5,12.8